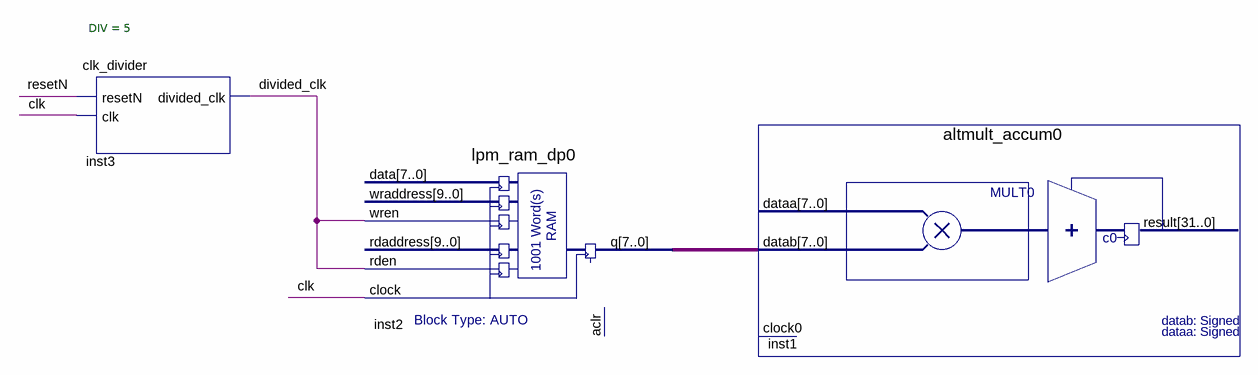
[diagram p0: schematic sheet]
// Quartus schematic auto_cor.bdf as structural Verilog: 3 symbols, 0 pins
module auto_cor (
);

  wire clk, divided_clk, resetN;
  wire [7:0] inst2_q;

  clk_divider #(.DIV(5)) inst3 (.resetN(resetN), .clk(clk), .divided_clk(divided_clk));
  lpm_ram_dp0 inst2 (
    .wren(divided_clk), .rden(divided_clk), .clock(clk), .q(inst2_q));  // open: data, wraddress, rdaddress, aclr
  altmult_accum0 inst1 (.datab(inst2_q));  // open: dataa, clock0, result
endmodule
